# EAGLE schematic GEMINI (EAGLE 9.4.2)
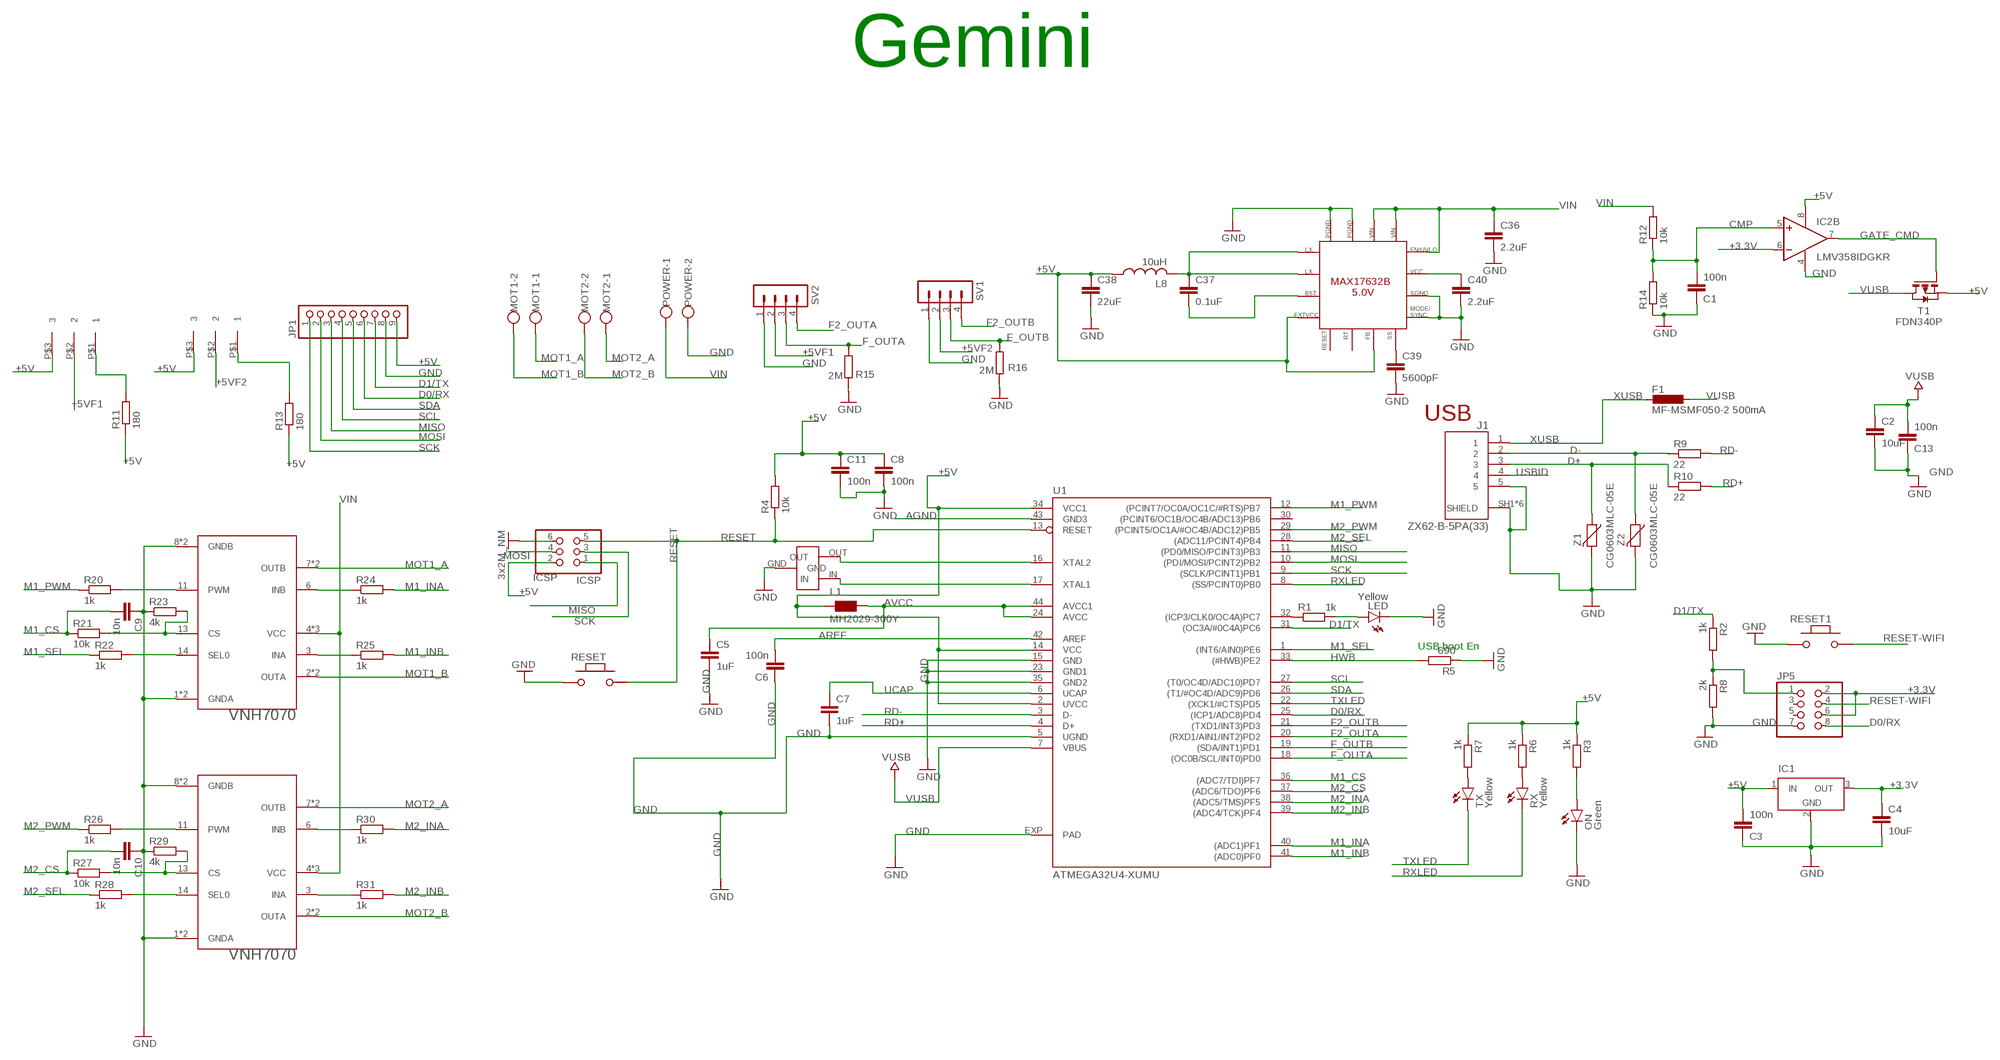
[diagram p0: schematic, sheet 1]

## Parts
C1  100n  C-EUC0402K  [C0402K]
C2  10uF  C-EUC0805  [C0805]
C3  100n  C-EUC0402K  [C0402K]
C4  10uF  C-EUC0805  [C0805]
C5  1uF  C-EUC0603  [C0603-ROUND]
C6  100n  C-EUC0402K  [C0402K]
C7  1uF  C-EUC0603  [C0603-ROUND]
C8  100n  C-EUC0402K  [C0402K]
C9  10n  CC0402  [C0402]
C10  10n  CC0402  [C0402]
C11  100n  C-EUC0402K  [C0402K]
C13  100n  C-EUC0402K  [C0402K]
C36  2.2uF  C-EUC0805  [C0805]
C37  0.1uF  C-EUC0805  [C0805]
C38  22uF  C-EUC0805  [C0805]
C39  5600pF  C-EUC0805  [C0805]
C40  2.2uF  C-EUC0805  [C0805]
F1  MF-MSMF050-2 500mA  L-EUL1812  [L1812]
IC1  LT1129CST5  [SOT223]
IC2  LMV358IDGKR  LMV358MMX  [MSOP08]
ICSP  ICSP  PINHD-2X3  [2X03]
J1  ZX62-B-5PA(33)  [HRS_ZX62-B-5PA(33)]
JP1  PINHD-1X9  [1X09-BIG]
JP5  PINHD-2X4  [2X04]
L1  MH2029-300Y  WE-CBF_0805  [0805]
L8  10uH  RCL_L-USL1812  [RCL_L1812]
LED  Yellow  LEDCHIPLED_0805  [CHIPLED_0805]
MOT1  W237-102  [W237-102]
MOT2  W237-102  [W237-102]
ON  Green  LEDCHIPLED_0805  [CHIPLED_0805]
POWER  W237-102  [W237-102]
R1  1k  RR0402  [R0402]
R2  1k  RR0402  [R0402]
R3  1k  RR0402  [R0402]
R4  10k  RR0402  [R0402]
R5  690  RR0402  [R0402]
R6  1k  RR0402  [R0402]
R7  1k  RR0402  [R0402]
R8  2k  RR0402  [R0402]
R9  22  RR0402  [R0402]
R10  22  RR0402  [R0402]
R11  180  RR0402  [R0402]
R12  10k  RR0402  [R0402]
R13  180  RR0402  [R0402]
R14  10k  RR0402  [R0402]
R15  2M  RR0402  [R0402]
R16  2M  RR0402  [R0402]
R20  1k  RR0402  [R0402]
R21  10k  RR0402  [R0402]
R22  1k  RR0402  [R0402]
R23  4k  RR0402  [R0402]
R24  1k  RR0402  [R0402]
R25  1k  RR0402  [R0402]
R26  1k  RR0402  [R0402]
R27  10k  RR0402  [R0402]
R28  1k  RR0402  [R0402]
R29  4k  RR0402  [R0402]
R30  1k  RR0402  [R0402]
R31  1k  RR0402  [R0402]
RESET  MYSMD_PB157  [SMD_157SW]
RESET1  MYSMD_PB157  [SMD_157SW]
RX  Yellow  LEDCHIPLED_0805  [CHIPLED_0805]
SV1  MA04-1  [MA04-1]
SV2  MA04-1  [MA04-1]
T1  FDN340P  PMOSSOT23  [SOT-23]
TX  Yellow  LEDCHIPLED_0805  [CHIPLED_0805]
U1  ATMEGA32U4-XUMU  [QFN44ML7X7]
U$1  RISONATORE  [RISONATORE]
U$2  2BRIDGE  [2BRIDGE]
U$3  MAX17632B  [QFN16]
U$4  2BRIDGE  [2BRIDGE]
U$29  VNH7070  [SO16]
U$32  VNH7070  [SO16]
Z1  CG0603MLC-05E  VARISTORCN0603  [CT/CN0603]
Z2  CG0603MLC-05E  VARISTORCN0603  [CT/CN0603]

## Nets
+3.3V [gnd]: C4.1 IC1.3(OUT) IC2.6(B:-IN) JP5.2 JP5.6
+5V [POWER]: C3.2 C8.1 C11.1 C38.1 IC1.1(IN) IC2.8(P:V+) ICSP.2 JP1.9 L1.1 L8.1 R3.1 R4.2 R6.1 R7.1 R11.1 R13.1 T1.2(S) U1.2(UVCC) U1.14(VCC) U1.34(VCC1) U$2.P$3 U$3.6(FB) U$3.9(EXTVCC) U$4.P$3
+5VF1 [POWER]: SV2.2 U$2.P$2
+5VF2 [POWER]: SV1.2 U$4.P$2
AGND: U1.43(GND3)
AREF [POWER]: C6.2 U1.42(AREF)
AVCC: C5.1 L1.2 U1.24(AVCC) U1.44(AVCC1)
CMP: C1.2 IC2.5(B:+IN) R12.1 R14.2
D0/RX: JP1.6 JP5.8 U1.25((ICP1/ADC8)PD4)
D1/TX: JP1.7 R2.1 U1.31((OC3A/#0C4A)PC6)
D+: J1.3 R10.1 Z1.1
D-: J1.2 R9.1 Z2.1
F2_OUTA: SV2.4 U1.20((RXD1/AIN1/INT2)PD2)
F2_OUTB: SV1.4 U1.21((TXD1/INT3)PD3)
F_OUTA: R15.1 SV2.3 U1.18((OC0B/SCL/INT0)PD0)
F_OUTB: R16.1 SV1.3 U1.19((SDA/INT1)PD1)
GATE_CMD: IC2.7(B:OUT) T1.3(G)
GND: C1.1 C2.2 C3.1 C4.2 C5.2 C6.1 C7.2 C8.2 C9.1 C10.1 C11.2 C13.1 C36.2 C38.2 C39.2 C40.2 IC1.2(GND) IC2.4(P:V-) ICSP.6 J1.5 J1.SH1(SHIELD) J1.SH2(SHIELD) J1.SH3(SHIELD) J1.SH4(SHIELD) J1.SH5(SHIELD) J1.SH6(SHIELD) JP1.8 JP5.7 LED.C ON.C POWER.2 R5.1 R8.2 R14.1 R15.2 R16.2 R23.1 R29.1 RESET1.2 RESET.2 SV1.1 SV2.1 U1.5(UGND) U1.15(GND) U1.23(GND1) U1.35(GND2) U1.EXP(PAD) U$1.GND U$3.3(SGND) U$3.4(MODESYNC) U$3.13(PGND1) U$3.14(PGND2) U$29.1(GNDA) U$29.8(GNDB) U$29.9(GNDB) U$29.16(GNDA) U$32.1(GNDA) U$32.8(GNDB) U$32.9(GNDB) U$32.16(GNDA) Z1.2 Z2.2 ; supply symbol labelled 3x2M_NM
HWB: R5.2 U1.33((#HWB)PE2)
M1_CS: C9.2 R21.1 U1.36((ADC7/TDI)PF7)
M1_INA: R24.2 U1.40((ADC1)PF1)
M1_INB: R25.2 U1.41((ADC0)PF0)
M1_PWM: R20.1 U1.12((PCINT7/OC0A/OC1C/#RTS)PB7)
M1_SEL: R22.1 U1.1((INT6/AIN0)PE6)
M2_CS: C10.2 R27.1 U1.37((ADC6/TDO)PF6)
M2_INA: R30.2 U1.38((ADC5/TMS)PF5)
M2_INB: R31.2 U1.39((ADC4/TCK)PF4)
M2_PWM: R26.1 U1.29((PCINT5/OC1A/#OC4B/ADC12)PB5)
M2_SEL: R28.1 U1.28((ADC11/PCINT4)PB4)
MISO: ICSP.1 JP1.3 U1.11((PD0/MISO/PCINT3)PB3)
MOSI: ICSP.4 JP1.2 U1.10((PDI/MOSI/PCINT2)PB2)
MOT1_A: MOT1.1 U$29.7(OUTB) U$29.10(OUTB)
MOT1_B: MOT1.2 U$29.2(OUTA) U$29.15(OUTA)
MOT2_A: MOT2.1 U$32.7(OUTB) U$32.10(OUTB)
MOT2_B: MOT2.2 U$32.2(OUTA) U$32.15(OUTA)
N$1: LED.A R1.2
N$2: R11.2 U$2.P$1
N$3: R13.2 U$4.P$1
N$4: ON.A R3.2
N$5: R6.2 RX.A
N$6: R7.2 TX.A
N$7: R21.2 R23.2 U$29.13(CS)
N$8: R22.2 U$29.14(SEL0)
N$9: R20.2 U$29.11(PWM)
N$10: R24.1 U$29.6(INB)
N$11: R25.1 U$29.3(INA)
N$12: R27.2 R29.2 U$32.13(CS)
N$13: R28.2 U$32.14(SEL0)
N$14: R26.2 U$32.11(PWM)
N$15: R30.1 U$32.6(INB)
N$16: R31.1 U$32.3(INA)
N$17: C37.2 U$3.10(BST)
N$18: C37.1 L8.2 U$3.11(LX1) U$3.12(LX2)
N$19: C39.1 U$3.5(SS)
N$20: C40.1 U$3.2(VCC)
N$21: R1.1 U1.32((ICP3/CLK0/OC4A)PC7)
N$22: JP5.1 R2.2 R8.1
N$29: U1.17(XTAL1) U$1.IN
N$30: U1.16(XTAL2) U$1.OUT
RD+: R10.2 U1.4(D+)
RD-: R9.2 U1.3(D-)
RESET: ICSP.5 R4.1 RESET.1 U1.13(RESET)
RESET-WIFI: JP5.4 RESET1.1
RXLED: RX.C U1.8((SS/PCINT0)PB0)
SCK: ICSP.3 JP1.1 U1.9((SCLK/PCINT1)PB1)
SCL: JP1.4 U1.27((T0/OC4D/ADC10)PD7)
SDA: JP1.5 U1.26((T1/#OC4D/ADC9)PD6)
TXLED: TX.C U1.22((XCK1/#CTS)PD5)
UCAP: C7.1 U1.6(UCAP)
USBID: J1.4
VIN [POWER]: C36.1 POWER.1 R12.2 U$3.1(ENUVLO) U$3.15(VIN1) U$3.16(VIN2) U$29.4(VCC) U$29.5(VCC) U$29.12(VCC) U$32.4(VCC) U$32.5(VCC) U$32.12(VCC)
VUSB: C2.1 C13.2 F1.1 T1.1(D) U1.7(VBUS)
XUSB [usbvcc]: F1.2 J1.1
Unconnected: IC2.1(A:OUT) IC2.2(A:-IN) IC2.3(A:+IN) JP5.3 JP5.5 U1.30((PCINT6/OC1B/OC4B/ADC13)PB6) U$3.7(RT) U$3.8(RESET)

## Notes on the sheet
- Gemini
- USB
- USB boot En

## Power pins joined to a net without a drawn wire
GND: IC1.4(GND)

## Library data of the parts
C1-C4 C6 C8 C11 C13 C36-C40 = rcl:C-EU: CAPACITOR, European symbol; SPICEPREFIX: C
C5 C7 = SmartPrj:C-EU: CAPACITOR, European symbol
C9 C10 = eagle-ltspice:C: CAPACITOR, European symbol; SPICEMODEL: NONE; SPICEPREFIX: C
F1 = rcl:L-EU: INDUCTOR, European symbol
IC1 = linear-technology:LT1129CST5: VOLTAGE REGULATOR with shutdown; MPN: LT1129CST-5#PBF; OC_FARNELL: 1663375; OC_NEWARK: 57M2069
IC2 = linear:LMV358?*: Dual General Purpose, Low Voltage, Rail-to-Rail Output Operational Amplifiers Source: http://www.national.com/mpf/LM/LMV321.html http://www.national.com/dt/lmv_qual.pdf
ICSP = SmartPrj:PINHD-2X3: PIN HEADER
J1 = MICROUSB:ZX62-B-5PA(33): ZX Series 5 Position Right Angle PCB Wire Micro B USB Plug; AVAILABILITY: Unavailable; DESCRIPTION: ZX Series 5 Position Right Angle PCB Wire Micro B USB Plug; MF: Hirose; MP: ZX62-B-5PA_33_; PACKAGE: None; PRICE: None
JP1 = adafruit:PINHD-1X9: Pin header 1x10 0.1" spacing With round pins
JP5 = pinhead:PINHD-2X4: PIN HEADER
L1 = wuerth-elektronik:WE-CBF: SMD EMI Suppression Ferrite Beads - excellent anti-EMI properties - low DCR - impedances till 3000 ohms - rated current up to 6 A
L8 = ZYON-TOXIC-5.0:RCL_L-US: INDUCTOR, American symbol
LED ON RX TX = led:LED: LED OSRAM: - CHIPLED LG R971, LG N971, LY N971, LG Q971, LY Q971, LO R971, LY R971 LH N974, LH R974 LS Q976, LO Q976, LY Q976 LO Q996 - Hyper CHIPLED LW Q18S LB Q993, LB Q99A, LB R99A - SideLED LS A670, LO A670, LY A670, LG A670, LP A670 LB A673, LV A673, LT A673, LW A673 LH A674 LY A675 LS A676, LA A676, LO A676, LY A676, LW A676 LS A679, LY A679, LG A679 - Hyper Micro SIDELED® LS Y876, LA Y876, LO Y876, LY Y876 LT Y87S - SmartLED LW L88C, LW L88S LB L89C, LB L89S, LG L890 LS L89K, LO L89K, LY L89K LS L896, LA L896, LO L896, LY L896 - TOPLED LS T670, LO T670, LY T670, LG T670, LP T670 LSG T670, LSP T670, LSY T670, LOP T670, LYG T670 LG T671, LOG T671, LSG T671 LB T673, LV T673, LT T673, LW T673 LH T674 LS T676, LA T676, LO T676, LY T676, LB T676, LH T676, LSB T676, LW T676 LB T67C, LV T67C, LT T67C, LS T67K, LO T67K, LY T67K, LW E67C LS E67B, LA E67B, LO E67B, LY E67B, LB E67C, LV E67C, LT E67C LW T67C LS T679, LY T679, LG T679 LS T770, LO T770, LY T770, LG T770, LP T770 LB T773, LV T773, LT T773, LW T773 LH T774 LS E675, LA E675, LY E675, LS T675 LS T776, LA T776, LO T776, LY T776, LB T776 LHGB T686 LT T68C, LB T68C - Hyper Mini TOPLED® LB M676 - Mini TOPLED Santana® LG M470 LS M47K, LO M47K, LY M47K Source: http://www.osram.convergy.de LUXEON: - LUMILED® LXK2-PW12-R00, LXK2-PW12-S00, LXK2-PW14-U00, LXK2-PW14-V00 LXK2-PM12-R00, LXK2-PM12-S00, LXK2-PM14-U00 LXK2-PE12-Q00, LXK2-PE12-R00, LXK2-PE12-S00, LXK2-PE14-T00, LXK2-PE14-U00 LXK2-PB12-K00, LXK2-PB12-L00, LXK2-PB12-M00, LXK2-PB14-N00, LXK2-PB14-P00, LXK2-PB14-Q00 LXK2-PR12-L00, LXK2-PR12-M00, LXK2-PR14-Q00, LXK2-PR14-R00 LXK2-PD12-Q00, LXK2-PD12-R00, LXK2-PD12-S00 LXK2-PH12-R00, LXK2-PH12-S00 LXK2-PL12-P00, LXK2-PL12-Q00, LXK2-PL12-R00 Source: www.luxeon.com KINGBRIGHT: KA-3528ASYC Source: www.kingbright.com
MOT1 MOT2 POWER = con-wago-500:W237-102: WAGO SCREW CLAMP; MPN: 237-102; OC_FARNELL: unknown; OC_NEWARK: 70K9898
R1-R16 R20-R31 = eagle-ltspice:R: RESISTOR, European symbol; SPICEMODEL: NONE; SPICEPREFIX: R
RESET RESET1 = SmartPrj:MYSMD_PB157
SV1 SV2 = con-lstb:MA04-1: PIN HEADER; OC_FARNELL: unknown; OC_NEWARK: unknown
T1 = zetex:PMOSSOT23: MOS FET
U1 = SmartPrj:ATMEGA32U4-XU
U$1 = risonatore:RISONATORE
U$2 U$4 = 2BRIDGE:2BRIDGE
U$3 = fixes:MAX17632B
U$29 U$32 = VNH7070:VNH7070
Z1 Z2 = varistor:VARISTOR: VARISTOR